# Altium schematic sheet 03_POWER_PROTECTION_MONITORING.SchDoc: =TitleParameter
size A3; Address: Crete IL; Organization: ASISGUARD; Address1: Kemalpasa, Kemalpasa Cd. No:290 D:292H, 35060 Bornova/Izmir/Turkey
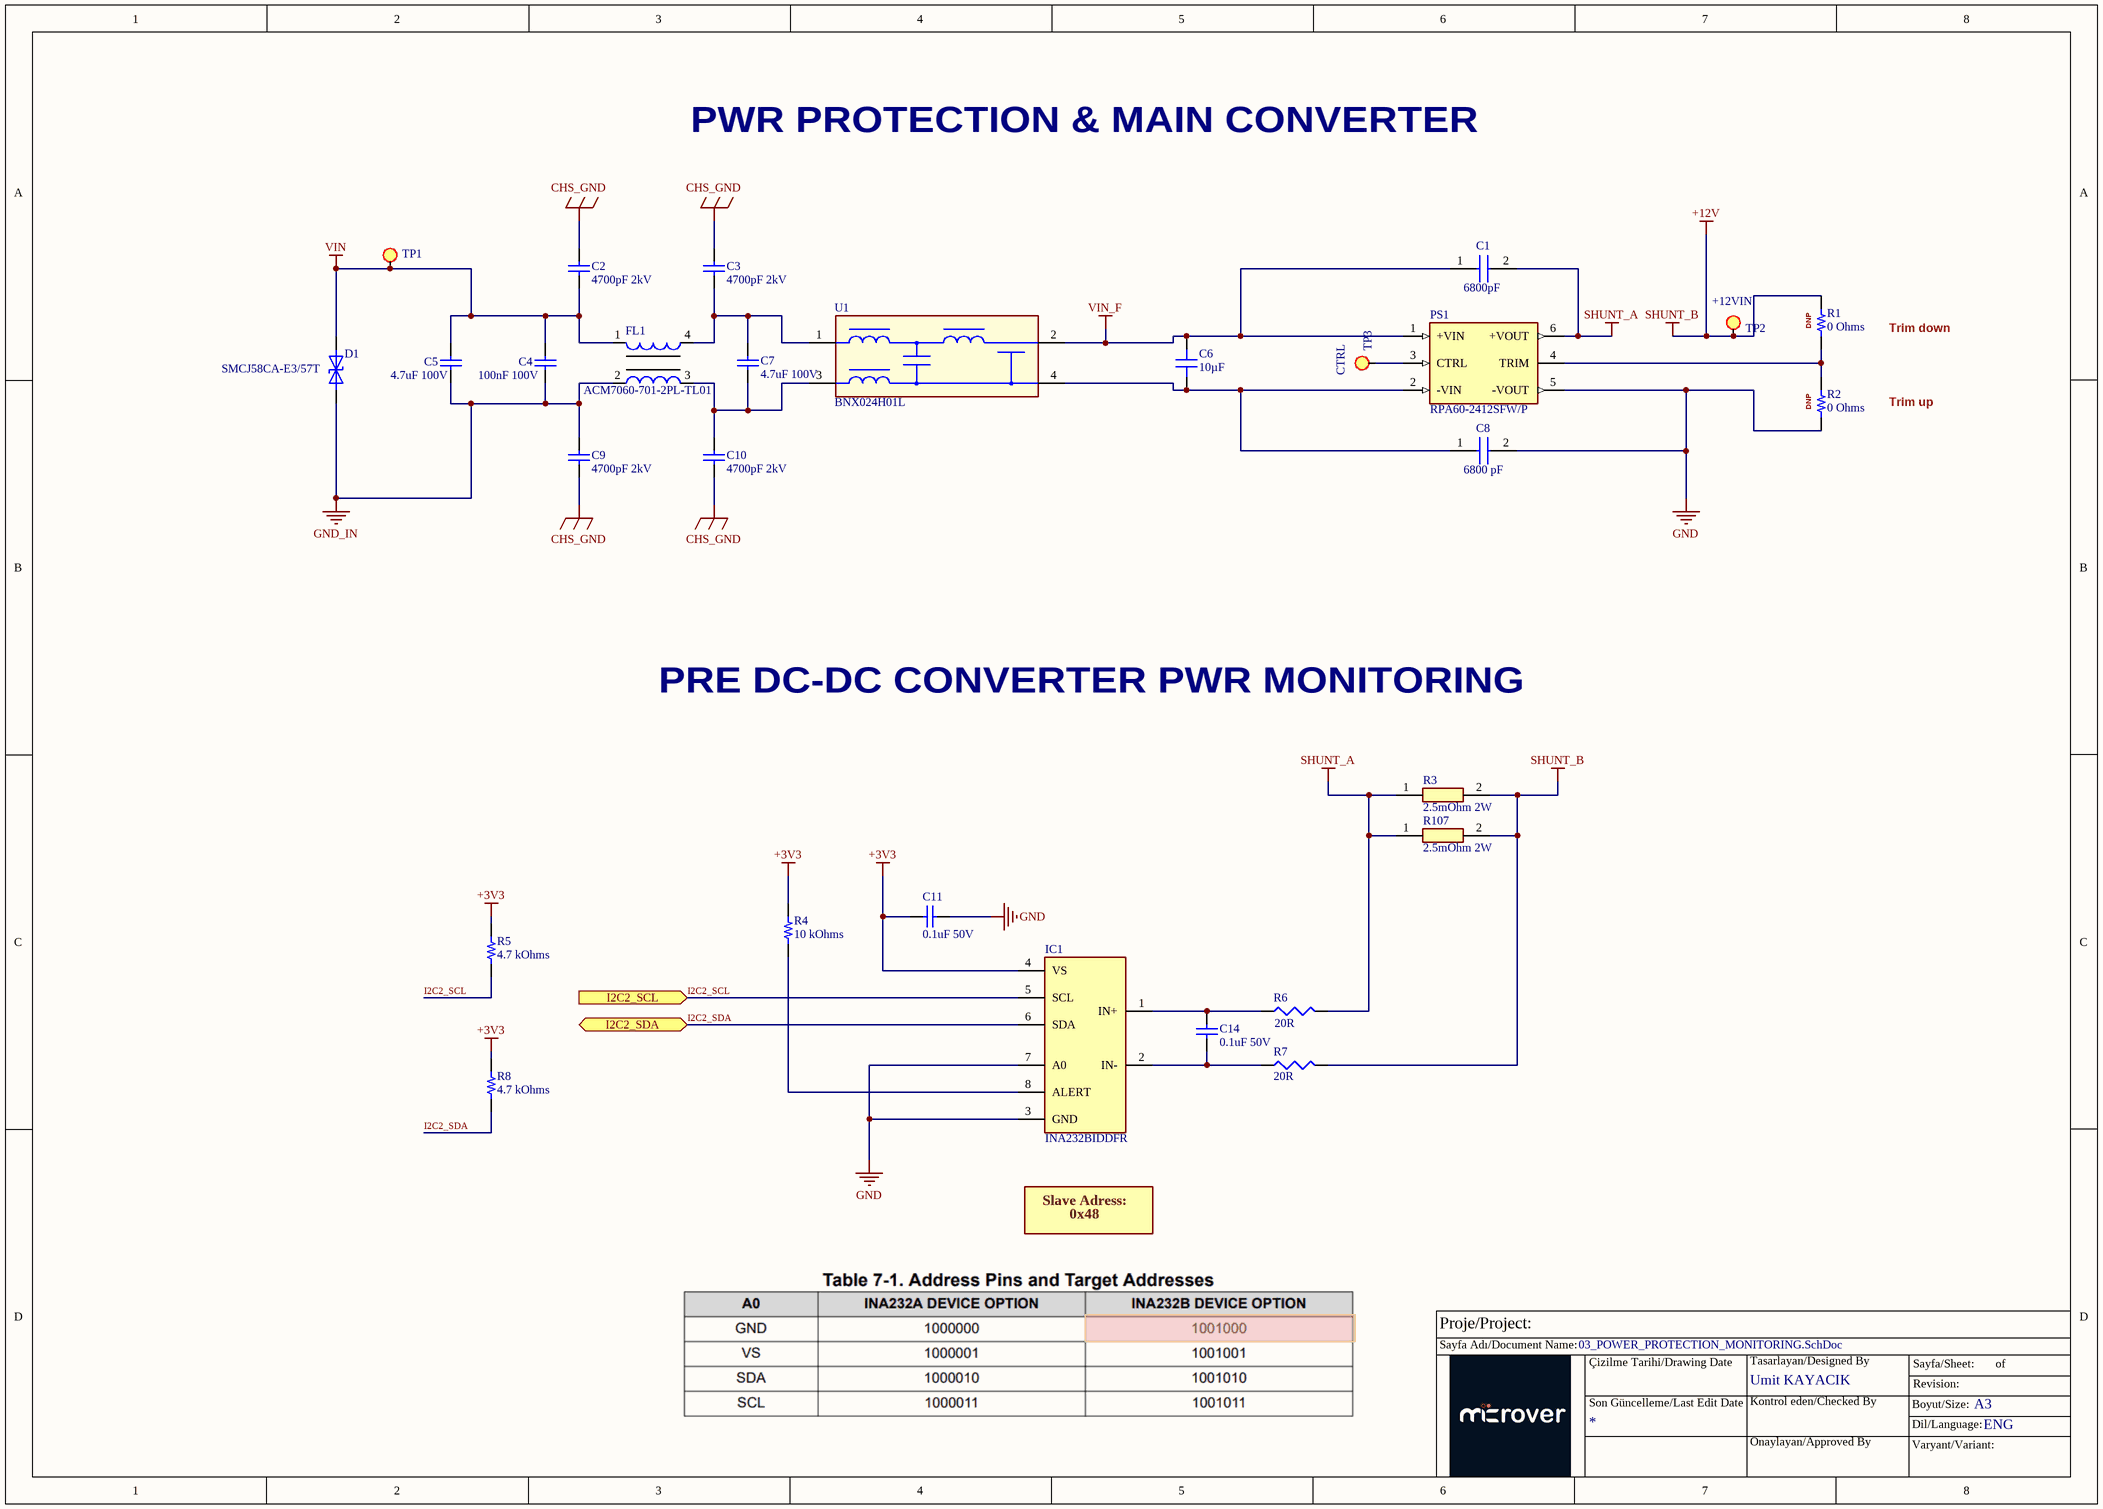
[diagram p0: 03_POWER_PROTECTION_MONITORING.SchDoc]

## Parts
C1  6800pF  [CAPC3225X280N]
C2  value 4700pF 2kV  [CAP1812]  (hidden comment: CAP CER 4700PF 2KV X7R 1812)
C3  value 4700pF 2kV  [CAP1812]  (hidden comment: CAP CER 4700PF 2KV X7R 1812)
C4  value 100nF 100V  [SMC0805]  (hidden comment: CAP CER 0.1UF 100V X7R 0805)
C5  value 4.7uF 100V  [CAP1210]  (hidden comment: CAP CER 4.7UF 100V X7S 1210)
C6  10µF  [CAP 1206_3216 - 1.8MM]
C7  value 4.7uF 100V  [CAP1210]  (hidden comment: CAP CER 4.7UF 100V X7S 1210)
C8  6800 pF  [CAPC3225X280N]
C9  value 4700pF 2kV  [CAP1812]  (hidden comment: CAP CER 4700PF 2KV X7R 1812)
C10  value 4700pF 2kV  [CAP1812]  (hidden comment: CAP CER 4700PF 2KV X7R 1812)
C11  value 0.1uF 50V  [SMC0603]  (hidden comment: CAP CER 0.1UF 50V X7R 0603)
C14  value 0.1uF 50V  [SMC0603]  (hidden comment: CAP CER 0.1UF 50V X7R 0603)
D1  SMCJ58CA-E3/57T  [DIOM7959X262N]
FL1  CMC 4A 2LN 700 OHM SMD  [TDK_0_MFG]  (value not drawn)
IC1  INA232BIDDFR  [SOT65P280X110-8N]
PS1  RPA60-2412SFW/P  [CONV_RPA60-2412SFW/P]
R1  0 Ohms  [RES 0402_1005]
R2  0 Ohms  [RES 0402_1005]
R3  2.5mOhm 2W  [RESC5125X89N]
R4  10 kOhms  [RES 0402_1005]
R5  4.7 kOhms  [RES 0603_1608]
R6  value 20R  [RES0603]  (hidden comment: RES 20 OHM 1% 1/10W 0603)
R7  value 20R  [RES0603]  (hidden comment: RES 20 OHM 1% 1/10W 0603)
R8  4.7 kOhms  [RES 0603_1608]
R107  2.5mOhm 2W  [RESC5125X89N]
TP1  VIN  [TEST_POINT_SMD]  (value not drawn)
TP2  +12VIN  [TEST_POINT_SMD]
TP3  CTRL  [TEST_POINT_SMD]
U1  FILTER LC 4.7UF SMD  [Murata_BNX02_MFG]  (value not drawn)

## Ports
I2C2_SCL (in), I2C2_SDA (bidir)

## Nets
+3V3: C11.1 IC1.4(VS) R4.2 R5.2 R8.2
+12V: R1.2 R3.2 R7.2 R107.2 TP2.1(TP)  [also labelled SHUNT_B]
CHS_GND: C2.2 C3.2 C9.1 C10.1
GND: C8.2 C11.2 IC1.3(GND) IC1.7(A0) PS1.5(-VOUT) R2.1
GND_IN: C4.1 C5.1 C9.2 D1.1 FL1.2
SHUNT_A: C1.2 PS1.6(+VOUT) R3.1 R6.2 R107.1
VIN: C2.1 C4.2 C5.2 D1.2 FL1.1 TP1.1(TP)
VIN_F: C1.1 C6.2 PS1.1(+VIN) U1.2(CB)
I2C2_SCL: IC1.5(SCL) R5.1 ; port I2C2_SCL
I2C2_SDA: IC1.6(SDA) R8.1 ; port I2C2_SDA
NetC3_1: C3.1 C7.2 FL1.4 U1.1(B)
NetC6_1: C6.1 C8.1 PS1.2(-VIN) U1.4(CG)
NetC7_1: C7.1 C10.2 FL1.3 U1.3(PSG)
NetC14_1: C14.1 IC1.2(IN-) R7.1
NetC14_2: C14.2 IC1.1(IN+) R6.1
NetIC1_8: IC1.8(ALERT) R4.1
NetPS1_3: PS1.3(CTRL) TP3.1(TP)
NetPS1_4: PS1.4(TRIM) R1.1 R2.2

## Notes on the sheet
- PWR PROTECTION & MAIN CONVERTER
- (near R1) DNP
- Trim down
- (near R2) DNP
- Trim up
- PRE DC-DC CONVERTER PWR MONITORING
- Slave Adress:
- 0x48
- Proje/Project:
- Sayfa Adı/Document Name:
- Çizilme Tarihi/Drawing Date
- Umit KAYACIK
- Tasarlayan/Designed By
- Sayfa/Sheet:
- Revision:
- of
- Son Güncelleme/Last Edit Date
- Kontrol eden/Checked By
- Onaylayan/Approved By
- Boyut/Size:
- Varyant/Variant:
- Dil/Language:
- A3
- ENG

## Library data of the parts
C1 = C1210C682MGRAC7800: CAP CER SMD 1210 6800PF 20% 2KV; Manufacturer_Name: KEMET; Datasheet Link: https://www.kemet.com/specsheet/C1210C682MGRACTU; Height: 2.8mm; Manufacturer_Part_Number: C1210C682MGRAC7800
C2 C3 C9 C10 = CAP1812_4700PF_2KV: 2kV 4.7nF X7R ±10% 1812 Multilayer Ceramic Capacitors MLCC - SMD/SMT ROHS; Manufacturer Part Number: 202S43W472KV4E; Order Code: *; Sirius Stock Code: *; LCSC Part Number: C167436; LCSC Manufacturer Part Number: 202S43W472KV4E
C4 = CAP0805_100nF_100V: 0.1 µF ±10% 100V Ceramic Capacitor X7R 0805 (2012 Metric); Manufacturer Part Number: CL21B104KCFNNNE; Order Code: DIGI : 1276-6840-1-ND; LCSC Manufacturer Part Number: CL21B104KCFNNNE; LCSC Part Number: C28233
C5 C7 = CAP1210_4.7UF_100V: 4.7 µF ±10% 100V Ceramic Capacitor X7S 1210 (3225 Metric); Manufacturer Part Number: CL32Y475KCIVPNE; Order Code: Digi: 1276-CL32Y475KCIVPNETR-ND; LCSC Manufacturer Part Number: CL32Y475KCIVPNE; LCSC Part Number: C2803397
C6 = 12065D106KAT2A: CAP CER 10UF 50V X5R 1206; manufacturer: AVX Corporation; Tolerance: ±10%; Part Number: 12065D106KAT2A; Value: 10µF; Applications: General Purpose; Capacitance: 10µF; componentlink1description: Datasheet; componentlink1url: http://datasheets.avx.com/cx5r.pdf; componentlink2description: DigiKey Link; componentlink2url: http://digikey.com/product-detail/en/avx-corporation/12065D106KAT2A/478-9979-1-ND/6149060; Device Package: 1206 (3216 Metric); lastupdated: 9/2/2020 1:05:35 AM; Lifecycle Status: Active; Minimum Order: 1; Mounting Type: Surface Mount, MLCC; Operating Temperature: -55°C ~ 85°C; Package / Case: 1206 (3216 Metric); packaging: TapeAndReel; partid: 21345; Part Status: Active; price: 0.16; series: -; Size / Dimension: 0.126" L x 0.063" W (3.20mm x 1.60mm); Supplier 1: DigiKey; Supplier Part Number 1: 478-9979-1-ND; Temperature Coefficient: X5R; Thickness (Max): 0.071" (1.80mm); Voltage - Rated: 50V
C8 = C1210C682MGRAC7800: Capacitor; Manufacturer_Name: KEMET; Datasheet Link: https://www.kemet.com/specsheet/C1210C682MGRACTU; Height: 2.8mm; Manufacturer_Part_Number: C1210C682MGRAC7800
C11 C14 = CAP0603_0.1UF_50V: 0.1 µF ±10% 50V Ceramic Capacitor X7R 0603 (1608 Metric); Manufacturer Part Number: CL10B104KB8NNNL; LCSC Manufacturer Part Number: CL10B104KB8NNNC; Order Code: DIGI:1276-CL10B104KB8NNNLTR-ND; Sirius Stock Code: A063-AGC10300001226; LCSC Part Number: C1591
D1 = SMCJ58CA-E3/57T: TransZorb 1500 W 58 V 93.6 Vcl Bi-Directional SMT TVS Diode - DO-214AB; Manufacturer: Vishay Semiconductors; Supplier 1: Digikey; Manufacturer Part Number: SMCJ58CA-E3/57T; RoHS: Yes; Category: TVS Diodes; Stock 1: 1611; Pricing 1: 1=0.64, 10=0.545, 100=0.3792 (USD); ComponentLink1URL: https://datasheet.ciiva.com/4247/smcj50a-4247736.pdf?src-supplier=Arrow+Electronics; ComponentLink1Description: https://datasheet.ciiva.com/4247/smcj50a-4247736.pdf?src-supplier=Arrow+Electronics; ComponentLink2URL: https://datasheet.ciiva.com/340/smcj50a-340997.pdf?src-supplier=Digikey; ComponentLink2Description: https://datasheet.ciiva.com/340/smcj50a-340997.pdf?src-supplier=Digikey; ComponentLink3URL: https://datasheet.ciiva.com/340/smcj50a-340998.pdf?src-supplier=Digikey; ComponentLink3Description: https://datasheet.ciiva.com/340/smcj50a-340998.pdf?src-supplier=Digikey; ComponentLink4URL: https://datasheet.ciiva.com/340/smcj50a-340999.pdf?src-supplier=Digikey; ComponentLink4Description: https://datasheet.ciiva.com/340/smcj50a-340999.pdf?src-supplier=Digikey; ComponentLink5URL: https://datasheet.ciiva.com/4508/smcj50a-241829-4508847.pdf?src-supplier=Mouser; ComponentLink5Description: https://datasheet.ciiva.com/4508/smcj50a-241829-4508847.pdf?src-supplier=Mouser; Supplier Part Number 1: SMCJ58CA-E3/57TGICT-ND
FL1 = ACM7060-701-2PL-TL01: 2 Line Common Mode Choke Surface Mount 700 Ohms @ 100 MHz 4A DCR 15mOhm; Order Code: Digi: 445-2215-2-ND; LCSC Manufacturer Part Number: ACM7060-701-2PL-TL01; LCSC Part Number: C78246; Manufacturer Part Number: ACM7060-701-2PL-TL01
IC1 = INA232BIDDFR: 48-V, 16-bit high-precision I²C output digital power monitor with alert 8-SOT-23-THIN -40 to 125; Manufacturer: Texas Instruments; Supplier 1: Digikey; Manufacturer Part Number: INA232BIDDFR; RoHS: No; Stock 1: 8755; Pricing 1: 1=2.5, 10=2.248, 25=2.1208, 100=1.8071, 250=1.6968, 500=1.4847, 1000=1.23018 (USD); Supplier Part Number 1: 296-INA232BIDDFRCT-ND
PS1 = RPA60-2412SFW/P: 60W DC/DC-Converter 'POWERLINE' 2 x1 1.5kV reg 4: ; V. In: 9-36; V. Out: 12; mA. Out: 5000; Manufacturer: Recom; Supplier 1: Digikey; Manufacturer Part Number: RPA60-2412SFW/P; RoHS: Yes; Category: Board Mount Modules; Stock 1: 3612; Pricing 1: 1=68.75, 5=66.14, 10=65.618, 25=63.5352, 50=60.4106, 100=56.2444 (USD); ComponentLink1URL: https://datasheet.octopart.com/RPA60-2412SFW-P-Recom-Power-datasheet-67314772.pdf?src-supplier=Newark; ComponentLink1Description: https://datasheet.octopart.com/RPA60-2412SFW-P-Recom-Power-datasheet-67314772.pdf?src-supplier=Newark; ComponentLink2URL: https://www.recom-power.com/pdf/Powerline-DC-DC/RPA60-FW.pdf?src-supplier=Digikey; ComponentLink2Description: https://www.recom-power.com/pdf/Powerline-DC-DC/RPA60-FW.pdf?src-supplier=Digikey; ComponentLink3URL: https://datasheet.octopart.com/RPA60-2412SFW-P-Recom-Power-datasheet-68305293.pdf?src-supplier=Sager+Electronics; ComponentLink3Description: https://datasheet.octopart.com/RPA60-2412SFW-P-Recom-Power-datasheet-68305293.pdf?src-supplier=Sager+Electronics; Supplier Part Number 1: 945-2958-ND
R1 R2 = HCJ0402ZT0R00: RES 0 OHM JUMPER 1/8W 0402; Manufacturer: Stackpole Electronics Inc; Power (Watts): 0.125W, 1/8W; Part Number: HCJ0402ZT0R00; Value: 0 Ohms; ComponentLink1Description: Datasheet; ComponentLink1URL: https://www.seielect.com/catalog/sei-hcj.pdf; ComponentLink2Description: DigiKey Link; ComponentLink2URL: https://www.digikey.com/en/products/detail/stackpole-electronics-inc/HCJ0402ZT0R00/4357659; Composition: Metal Foil; Device Package: 0402 (1005 Metric); Features: Automotive AEC-Q200; Height - Seated (Max): 0.018" (0.45mm); LastUpdated: 2/9/2024 8:29:49 PM; Lifecycle Status: Active; Minimum Order: 1; Number of Terminations: 2; Operating Temperature: -55°C ~ 155°C; Package / Case: 0402 (1005 Metric); Packaging: TapeAndReel; PartId: 12327; Part Status: Active; Price: 0.07; Ratings: AEC-Q200; Resistance: 0 Ohms; Series: HCJ; Size / Dimension: 0.039" L x 0.020" W (1.00mm x 0.50mm); Supplier 1: DigiKey; Supplier Part Number 1: HCJ0402ZT0R00CT-ND; Supplier Device Package: 0402; Tolerance: Jumper
R3 R107 = WSLP20102L500FEA: Resistor; Manufacturer_Name: Vishay; Datasheet Link: https://www.vishay.com/doc?30122; Height: 0.889mm; Manufacturer_Part_Number: WSLP20102L500FEA; Mouser Part Number: N/A; Mouser Price/Stock: https://www.mouser.co.uk/ProductDetail/Vishay-Dale/WSLP20102L500FEA?qs=%2FCXICPRLKg%252BjdjH3wDEueQ%3D%3D
R4 = RP73PF1E10KBTD: RES 10K OHM 0.1% 1/10W 0402; Manufacturer: TE Connectivity Passive Product; Power (Watts): 0.1W, 1/10W; Temperature Coefficient: ±25ppm/°C; Part Number: RP73PF1E10KBTD; Value: 10 kOhms; ComponentLink1Description: Datasheet; ComponentLink1URL: https://www.te.com/commerce/DocumentDelivery/DDEController?Action=srchrtrv&DocNm=1773272&DocType=DS&DocLang=English; ComponentLink2Description: DigiKey Link; ComponentLink2URL: https://www.digikey.com/en/products/detail/te-connectivity-passive-product/RP73PF1E10KBTD/8260957; Composition: Thin Film; Device Package: 0402 (1005 Metric); Height - Seated (Max): 0.014" (0.35mm); LastUpdated: 2/9/2024 8:30:24 PM; Lifecycle Status: Active; Minimum Order: 1; Number of Terminations: 2; Operating Temperature: -55°C ~ 155°C; Package / Case: 0402 (1005 Metric); Packaging: TapeAndReel; PartId: 2434; Part Status: Active; Price: 0.08; Resistance: 10 kOhms; Series: RP73, Holsworthy; Size / Dimension: 0.039" L x 0.020" W (1.00mm x 0.50mm); Supplier 1: DigiKey; Supplier Part Number 1: A127415CT-ND; Supplier Device Package: 0402; Tolerance: ±0.1%
R5 R8 = RN73R1JTTD4701B25: RES 4.7K OHM 0.1% 1/10W 0603; Manufacturer: KOA Speer Electronics, Inc.; Power (Watts): 0.1W, 1/10W; Temperature Coefficient: ±25ppm/°C; Part Number: RN73R1JTTD4701B25; Value: 4.7 kOhms; ComponentLink1Description: Datasheet; ComponentLink1URL: //media.digikey.com/pdf/Data%20Sheets/KOA%20Speer/RN73R_Type_DS.pdf; ComponentLink2Description: DigiKey Link; ComponentLink2URL: https://www.digikey.com/en/products/detail/koa-speer-electronics-inc/RN73R1JTTD4701B25/9991881; Composition: Thin Film; Device Package: 0603 (1608 Metric); Features: Automotive AEC-Q200, Moisture Resistant; Height - Seated (Max): 0.022" (0.55mm); LastUpdated: 2/9/2024 8:43:22 PM; Lifecycle Status: Active; Minimum Order: 1; Number of Terminations: 2; Operating Temperature: -55°C ~ 155°C; Package / Case: 0603 (1608 Metric); Packaging: TapeAndReel; PartId: 8410; Part Status: Active; Price: 0.05; Ratings: AEC-Q200; Resistance: 4.7 kOhms; Series: RN73R; Size / Dimension: 0.063" L x 0.031" W (1.60mm x 0.80mm); Supplier 1: DigiKey; Supplier Part Number 1: 2019-RN73R1JTTD4701B25CT-ND; Supplier Device Package: 0603; Tolerance: ±0.1%
R6 R7 = RES0603_20R_%1: 20 Ohms ±1% 0.1W, 1/10W Chip Resistor 0603 (1608 Metric) Automotive AEC-Q200 Thick Film; Manufacturer Part Number: RMCF0603FT20R0; LCSC Manufacturer Part Number: WR06X20R0FTL; Order Code: Digi: RMCF0603FT20R0TR-ND; Sirius Stock Code: *; LCSC Part Number: C163881
TP1-TP3 = TP: DESIG: testing PAD; FAB: NA; VAL: NOT POPULATED; PCB Footprint: test0_8-smd; REF: NA
U1 = BNX024H01L: LC EMI Filter 5th Order Low Pass 2 Channel C = 4.7µF 20 A 4-SMD, No Lead; Order Code: Digi: 490-7833-2-ND; LCSC Manufacturer Part Number: BNX024H01L; LCSC Part Number: C124739; Manufacturer Part Number: BNX024H01L